# Altium schematic sheet CW340_EdgeConnector.SchDoc: Edge Connector
size Letter; Organization: NewAE Technology Inc.; Address1: 1083 Queen St., Suite 196; Address2: Halifax; Address3: NS; Address4: Canada B3H 0B2; SheetApproved: NO
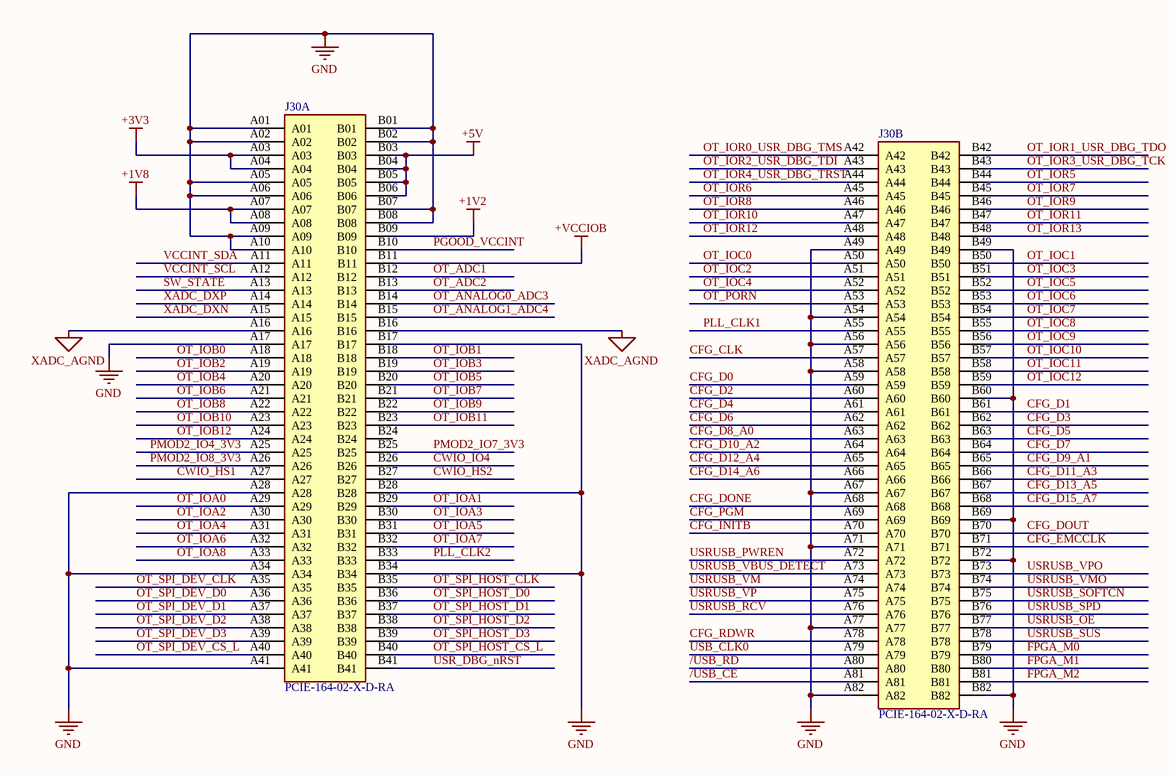
[diagram p0: CW340_EdgeConnector.SchDoc]

## Parts
J30  PCIE-164-02-X-D-RA  [SAMTEC_PCIE-164-02-X-D-RA]  (parts A,B of 2)

## Nets
+1V2: J30.B09
+1V8: J30.A07 J30.A08
+3V3: J30.A03 J30.A04
+5V: J30.B03 J30.B04 J30.B05 J30.B06
+VCCIOB: J30.B11
GND: J30.A01 J30.A02 J30.A05 J30.A06 J30.A09 J30.A10 J30.A17 J30.A28 J30.A34 J30.A41 J30.A49 J30.A54 J30.A56 J30.A58 J30.A67 J30.A71 J30.A77 J30.A82 J30.B01 J30.B02 J30.B07 J30.B08 J30.B17 J30.B28 J30.B34 J30.B49 J30.B60 J30.B69 J30.B72 J30.B82
XADC_AGND: J30.A16 J30.B16
/USB_CE: J30.A81
/USB_RD: J30.A80
CFG_CLK: J30.A57
CFG_D0: J30.A59
CFG_D1: J30.B61
CFG_D2: J30.A60
CFG_D3: J30.B62
CFG_D4: J30.A61
CFG_D5: J30.B63
CFG_D6: J30.A62
CFG_D7: J30.B64
CFG_D8_A0: J30.A63
CFG_D9_A1: J30.B65
CFG_D10_A2: J30.A64
CFG_D11_A3: J30.B66
CFG_D12_A4: J30.A65
CFG_D13_A5: J30.B67
CFG_D14_A6: J30.A66
CFG_D15_A7: J30.B68
CFG_DONE: J30.A68
CFG_DOUT: J30.B70
CFG_EMCCLK: J30.B71
CFG_INITB: J30.A70
CFG_PGM: J30.A69
CFG_RDWR: J30.A78
CWIO_HS1: J30.A27
CWIO_HS2: J30.B27
CWIO_IO4: J30.B26
FPGA_M0: J30.B79
FPGA_M1: J30.B80
FPGA_M2: J30.B81
OT_ADC1: J30.B12
OT_ADC2: J30.B13
OT_ANALOG0_ADC3: J30.B14
OT_ANALOG1_ADC4: J30.B15
OT_IOA0: J30.A29
OT_IOA1: J30.B29
OT_IOA2: J30.A30
OT_IOA3: J30.B30
OT_IOA4: J30.A31
OT_IOA5: J30.B31
OT_IOA6: J30.A32
OT_IOA7: J30.B32
OT_IOA8: J30.A33
OT_IOB0: J30.A18
OT_IOB1: J30.B18
OT_IOB2: J30.A19
OT_IOB3: J30.B19
OT_IOB4: J30.A20
OT_IOB5: J30.B20
OT_IOB6: J30.A21
OT_IOB7: J30.B21
OT_IOB8: J30.A22
OT_IOB9: J30.B22
OT_IOB10: J30.A23
OT_IOB11: J30.B23
OT_IOB12: J30.A24
OT_IOC0: J30.A50
OT_IOC1: J30.B50
OT_IOC2: J30.A51
OT_IOC3: J30.B51
OT_IOC4: J30.A52
OT_IOC5: J30.B52
OT_IOC6: J30.B53
OT_IOC7: J30.B54
OT_IOC8: J30.B55
OT_IOC9: J30.B56
OT_IOC10: J30.B57
OT_IOC11: J30.B58
OT_IOC12: J30.B59
OT_IOR0_USR_DBG_TMS: J30.A42
OT_IOR1_USR_DBG_TDO: J30.B42
OT_IOR2_USR_DBG_TDI: J30.A43
OT_IOR3_USR_DBG_TCK: J30.B43
OT_IOR4_USR_DBG_TRST: J30.A44
OT_IOR5: J30.B44
OT_IOR6: J30.A45
OT_IOR7: J30.B45
OT_IOR8: J30.A46
OT_IOR9: J30.B46
OT_IOR10: J30.A47
OT_IOR11: J30.B47
OT_IOR12: J30.A48
OT_IOR13: J30.B48
OT_PORN: J30.A53
OT_SPI_DEV_CLK: J30.A35
OT_SPI_DEV_CS_L: J30.A40
OT_SPI_DEV_D0: J30.A36
OT_SPI_DEV_D1: J30.A37
OT_SPI_DEV_D2: J30.A38
OT_SPI_DEV_D3: J30.A39
OT_SPI_HOST_CLK: J30.B35
OT_SPI_HOST_CS_L: J30.B40
OT_SPI_HOST_D0: J30.B36
OT_SPI_HOST_D1: J30.B37
OT_SPI_HOST_D2: J30.B38
OT_SPI_HOST_D3: J30.B39
PGOOD_VCCINT: J30.B10
PLL_CLK1: J30.A55
PLL_CLK2: J30.B33
PMOD2_IO4_3V3: J30.A25
PMOD2_IO7_3V3: J30.B25
PMOD2_IO8_3V3: J30.A26
SW_STATE: J30.A13
USB_CLK0: J30.A79
USR_DBG_nRST: J30.B41
USRUSB_OE: J30.B77
USRUSB_PWREN: J30.A72
USRUSB_RCV: J30.A76
USRUSB_SOFTCN: J30.B75
USRUSB_SPD: J30.B76
USRUSB_SUS: J30.B78
USRUSB_VBUS_DETECT: J30.A73
USRUSB_VM: J30.A74
USRUSB_VMO: J30.B74
USRUSB_VP: J30.A75
USRUSB_VPO: J30.B73
VCCINT_SCL: J30.A12
VCCINT_SDA: J30.A11
XADC_DXN: J30.A15
XADC_DXP: J30.A14

Not connected (* = marked no-connect by the designer): J30 B24

## Notes on the sheet
- Title:
- Date:
- Rev:
- Time:
- Project:
- Sheet
- of
- License:
- Copyright © NewAE Technology Inc.
- Approved:
- NewAE.com
- File:

## Library data of the parts
J30 = PCIE-164-02-X-D-RA: 1.00 mm PCI ExpressÂ® Edge Card Connector; MF: Samtec; Value: *; Price: None; Availability: Unavailable; Package: None; MP: PCIE-164-02-X-D-RA